# Altium schematic sheet EW-02-Schematic.SchDoc
size A4
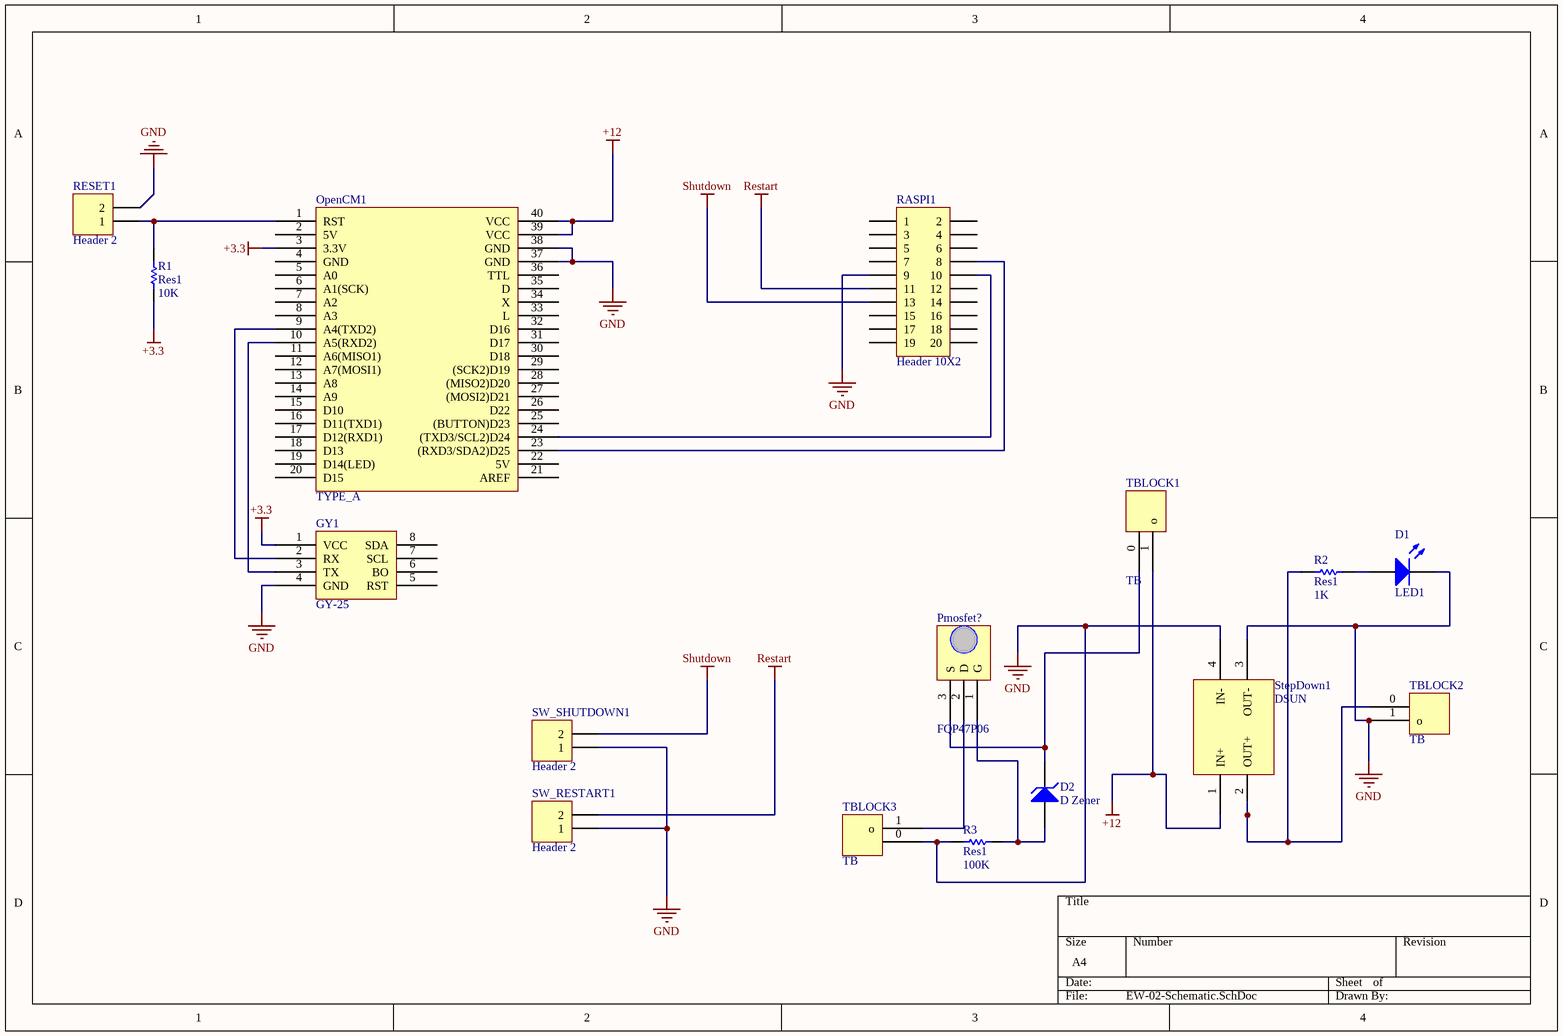
[diagram p0: EW-02-Schematic.SchDoc]

## Parts
D1  LED1  [LED]
D2  D Zener  [DO-Z]
GY1  GY-25  [PCBComponent_1]
OpenCM1  TYPE_A  [openCM9.04]
Pmosfet?  FQP47P06  [PCBComponent_1]
R1  Res1  value 10K  [AXIAL-0.3]
R2  Res1  value 1K  [AXIAL-0.3]
R3  Res1  value 100K  [AXIAL-0.3]
RASPI1  Header 10X2  [HDR2X10]
RESET1  Header 2  [HDR1X2]
StepDown1  DSUN  [PCBComponent_1]
SW_RESTART1  Header 2  [HDR1X2]
SW_SHUTDOWN1  Header 2  [HDR1X2]
TBLOCK1  TB  [PCBComponent_1]
TBLOCK2  TB  [PCBComponent_1]
TBLOCK3  TB  [PCBComponent_1]

## Nets
+3.3: GY1.1(VCC) OpenCM1.3(3.3V) R1.1
+12: OpenCM1.39(VCC) OpenCM1.40(VCC) StepDown1.1(IN+) TBLOCK1.1(o)
GND: D1.2(K) GY1.4(GND) OpenCM1.37(GND) OpenCM1.38(GND) R3.2 RASPI1.9 RESET1.2 StepDown1.3(OUT-) StepDown1.4(IN-) SW_RESTART1.1 SW_SHUTDOWN1.1 TBLOCK2.1(o) TBLOCK3.0
Restart: RASPI1.11 SW_RESTART1.2
Shutdown: RASPI1.13 SW_SHUTDOWN1.2
NetD1_1: D1.1(A) R2.2
NetD2_1: D2.1(A) Pmosfet?.1(G) R3.1
NetD2_2: D2.2(K) Pmosfet?.3(S) TBLOCK1.0
NetGY1_2: GY1.2(RX) OpenCM1.9(A4(TXD2))
NetGY1_3: GY1.3(TX) OpenCM1.10(A5(RXD2))
NetOpenCM1_1: OpenCM1.1(RST) R1.2 RESET1.1
NetOpenCM1_23: OpenCM1.23((RXD3/SDA2)D25) RASPI1.8
NetOpenCM1_24: OpenCM1.24((TXD3/SCL2)D24) RASPI1.10
NetPmosfet?_2: Pmosfet?.2(D) TBLOCK3.1(o)
NetR2_1: R2.1 StepDown1.2(OUT+) TBLOCK2.0

Not connected (* = marked no-connect by the designer): GY1 5(RST) 6(BO) 7(SCL) 8(SDA); OpenCM1 2(5V) 4(GND) 5(A0) 6(A1(SCK)) 7(A2) 8(A3) 11(A6(MISO1)) 12(A7(MOSI1)) 13(A8) 14(A9) 15(D10) 16(D11(TXD1)) 17(D12(RXD1)) 18(D13) 19(D14(LED)) 20(D15) 21(AREF) 22(5V) 25((BUTTON)D23) 26(D22) 27((MOSI2)D21) 28((MISO2)D20) 29((SCK2)D19) 30(D18) 31(D17) 32(D16) 33(L) 34(X) 35(D) 36(TTL); RASPI1 1 2 3 4 5 6 7 12 14 15 16 17 18 19 20

## Library data of the parts
D1 = LED1: Typical RED GaAs LED; Published: 8-Jun-2000; LatestRevisionDate: 08-Jul-2005; LatestRevisionNote: Mech Layer 1 removed.; PackageReference: LED-1; Publisher: Altium Limited; PackageDescription: LED; 2 Leads
D2 = D Zener: Zener Diode; Published: 8-Jun-2000; LatestRevisionDate: 17-Jul-2002; LatestRevisionNote: Re-released for DXP Platform.; PackageReference: DIODE-0.7; Publisher: Altium Limited; PackageDescription: Diode, Thru-Hole; 2 Leads; 0.7 in Pin Spacing
GY1 = GY-25: GY_25
OpenCM1 = TYPE_A: OpenCM 9.04
R1-R3 = Res1: Resistor; Published: 8-Jun-2000; LatestRevisionDate: 17-Jul-2002; LatestRevisionNote: Re-released for DXP Platform.; PackageReference: AXIAL-0.3; Publisher: Altium Limited; PackageDescription: Axial Device, Thru-Hole; 2 Leads; 0.3 in Pin Spacing
RASPI1 = Header 10X2: Header, 10-Pin, Dual row; LatestRevisionDate: 17-Jul-2002; LatestRevisionNote: Re-released for DXP Platform.; Publisher: Altium Limited
RESET1 SW_RESTART1 SW_SHUTDOWN1 = Header 2: Header, 2-Pin; LatestRevisionDate: 17-Jul-2002; LatestRevisionNote: Re-released for DXP Platform.; Publisher: Altium Limited
StepDown1 = DSUN: SD